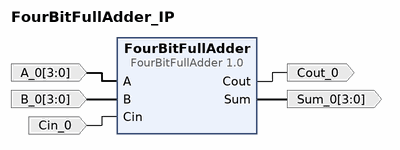
[diagram p0: block diagram of the top level]
# Vivado block design FourBitFullAdder_IP, xc7k70tfbv676-1, Vivado 2024.1
create_bd_design FourBitFullAdder_IP

create_bd_port -dir I -from 3 -to 0 A_0
create_bd_port -dir I -from 3 -to 0 B_0
create_bd_port -dir I Cin_0
create_bd_port -dir O Cout_0
create_bd_port -dir O -from 3 -to 0 Sum_0

create_bd_cell -type ip -vlnv xilinx.com:user:FourBitFullAdder:1.0 FourBitFullAdder

# ---- connections ----

connect_bd_net -net A_0_1 [get_bd_ports A_0] [get_bd_pins FourBitFullAdder/A]
connect_bd_net -net B_0_1 [get_bd_ports B_0] [get_bd_pins FourBitFullAdder/B]
connect_bd_net -net Cin_0_1 [get_bd_ports Cin_0] [get_bd_pins FourBitFullAdder/Cin]
connect_bd_net [get_bd_pins FourBitFullAdder/Cout] [get_bd_ports Cout_0]
connect_bd_net [get_bd_pins FourBitFullAdder/Sum] [get_bd_ports Sum_0]

validate_bd_design
save_bd_design
